# Altium schematic sheet Power.SchDoc
size A4
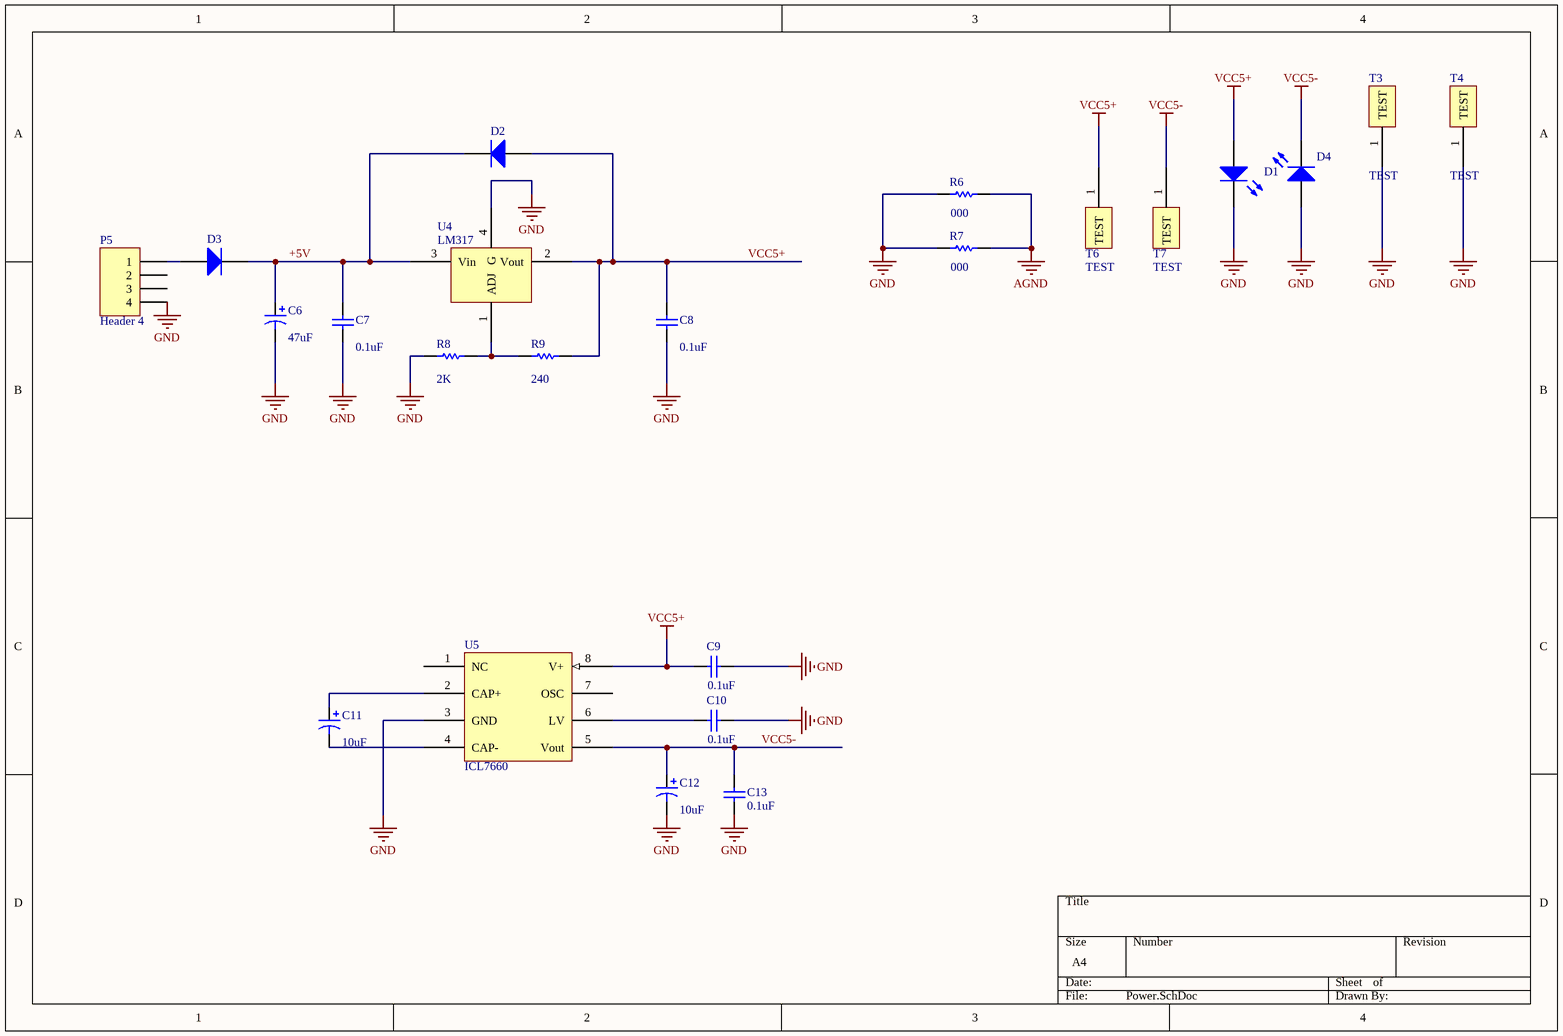
[diagram p0: Power.SchDoc]

## Parts
C6  value 47uF  [6032]  (hidden comment: Cap Pol3)
C7  value 0.1uF  [1206]  (hidden comment: Cap Semi)
C8  value 0.1uF  [1206]  (hidden comment: Cap Semi)
C9  value 0.1uF  [1206]  (hidden comment: Cap Semi)
C10  value 0.1uF  [1206]  (hidden comment: Cap Semi)
C11  value 10uF  [1206]  (hidden comment: Cap Pol3)
C12  value 10uF  [1206]  (hidden comment: Cap Pol3)
C13  value 0.1uF  [1206]  (hidden comment: Cap Semi)
D1  LED2  [0805_LED]  (value not drawn)
D2  Diode  [1N5824]  (value not drawn)
D3  Diode  [1N5824]  (value not drawn)
D4  LED2  [0805_LED]  (value not drawn)
P5  Header 4  [HDR1X4]
R6  value 000  [1206]  (hidden comment: Res Semi)
R7  value 000  [0805R]  (hidden comment: Res Semi)
R8  value 2K  [1206]  (hidden comment: Res Semi)
R9  value 240  [1206]  (hidden comment: Res Semi)
T3  TEST  [TEST]
T4  TEST  [TEST]
T6  TEST  [TEST_2]
T7  TEST  [TEST_2]
U4  LM317  [SOT223]
U5  ICL7660  [SO8]

## Nets
AGND: R6.2 R7.2
GND: C6.2 C7.1 C8.2 C9.2 C10.2 C12.2 C13.1 D1.2(K) D4.1(A) P5.4 R6.1 R7.1 R8.1 T3.1(TEST) T4.1(TEST) U4.4(G) U5.3(GND)
VCC5+: C8.1 C9.1 D1.1(A) D2.1(A) R9.2 T6.1(TEST) U4.2(Vout) U5.8(V+)
VCC5-: C12.1 C13.2 D4.2(K) T7.1(TEST) U5.5(Vout)
+5V: C6.1 C7.2 D2.2(K) D3.2(K) U4.3(Vin)
NetC10_1: C10.1 U5.6(LV)
NetC11_1: C11.1 U5.2(CAP+)
NetC11_2: C11.2 U5.4(CAP-)
NetD3_1: D3.1(A) P5.1
NetR8_2: R8.2 R9.1 U4.1(ADJ)

Not connected (* = marked no-connect by the designer): P5 2 3; U5 1(NC) 7(OSC)

## Library data of the parts
C6 C11 C12 = Cap Pol3: Polarized Capacitor (Surface Mount); Published: 8-Jun-2000; LatestRevisionDate: 29-May-2009; LatestRevisionNote: IPC-7351 Footprint Added.; PackageReference: C0805; Publisher: Altium Limited; PackageDescription: Chip Capacitor
C7-C10 C13 = Cap Semi: Capacitor (Semiconductor SIM Model); Published: 8-Jun-2000; LatestRevisionDate: 29-May-2009; LatestRevisionNote: IPC-7351 Footprint Added.; PackageReference: C1206; Publisher: Altium Limited; PackageDescription: Chip Capacitor
D1 D4 = LED2: Typical RED, GREEN, YELLOW, AMBER GaAs LED; Published: 8-Jun-2000; LatestRevisionDate: 17-Jul-2002; LatestRevisionNote: Re-released for DXP Platform.; PackageVersion: Feb-2002; PackageReference: 3.2X1.6X1.1; Publisher: Altium Limited
D2 D3 = Diode: Default Diode; Published: 8-Jun-2000; LatestRevisionDate: 17-Jul-2002; LatestRevisionNote: Re-released for DXP Platform.; PackageVersion: Sep-1996; PackageReference: SMC; Publisher: Altium Limited; Code_JEDEC: DO-214-AB
P5 = Header 4: Header, 4-Pin; LatestRevisionDate: 17-Jul-2002; LatestRevisionNote: Re-released for DXP Platform.; Publisher: Altium Limited
R6-R9 = Res Semi: Semiconductor Resistor; Published: 8-Jun-2000; LatestRevisionDate: 17-Jul-2002; LatestRevisionNote: Re-released for DXP Platform.; PackageReference: AXIAL-0.5; Publisher: Altium Limited